# Altium project W65C22N6TPLG-14 to DIP VIA 6522 Adapter.PrjPcb
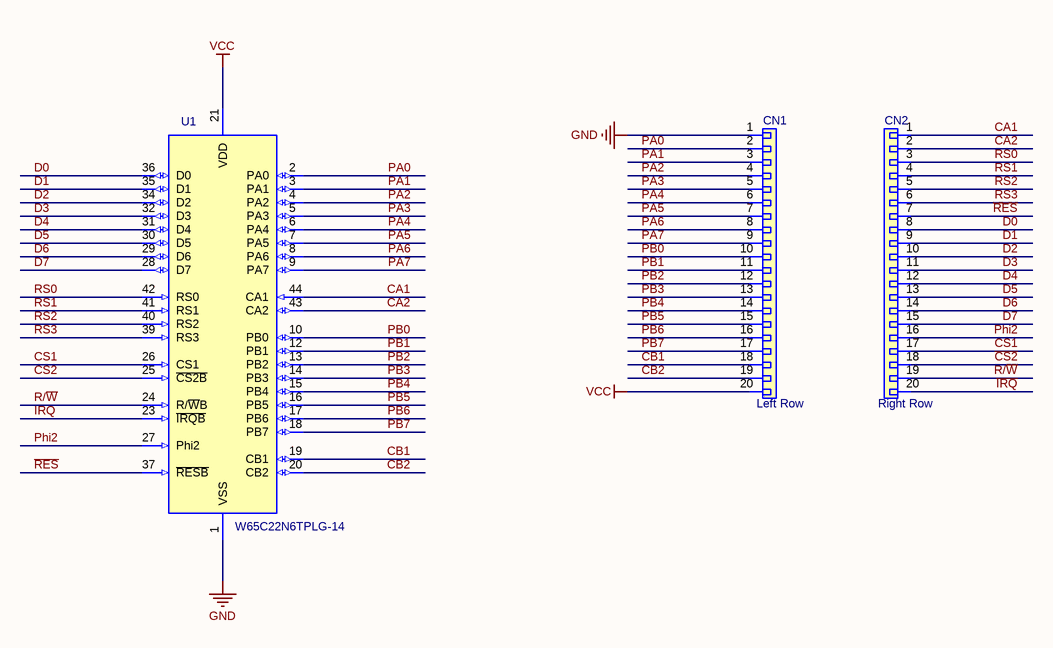
[diagram p0: W65C22N6TPLG-14 to DIP VIA 6522 Adapter.SchDoc]
Author: PCB-Tech; Revision: A; Title: Projektname; Version: 1.0
1 sheet, 3 parts. Net scope: global (net labels, ports and power ports of the same name join across sheets).
Board file: W65C22N6TPLG-14 to DIP VIA 6522 Adapter.PcbDoc

## Sheet W65C22N6TPLG-14 to DIP VIA 6522 Adapter.SchDoc: W65C22N6TPLG-14 to DIP VIA 6522 Adapter
size 297 x 209 mm; ApprovedBy: .; CheckedBy: .; Author: DiWou; CompanyName: DL2DW; DrawnBy: DiWou; Engineer: .; Organization: DL2DW; DocumentNumber: 1; Revision: -; SheetNumber: 1; SheetTotal: 1; DrawnDate: 03.09.2019; EngrDate: .; ChkdDate: .; Title1: W65C22N6TPLG-14 to; Title2: DIP VIA 6522 Adapterq; Title3: .; Desc1: Version 1.0; Desc2: .; ApprDate: .

### Parts
CN1  Left Row  [Pin Header 01x20 2.54mm precision Horizontal Male]
CN2  Right Row  [Pin Header 01x20 2.54mm precision Horizontal Male]
U1  W65C22N6TPLG-14  [W65C22N6TPLG-14 with PLCC Socket]

### Nets
GND: CN1.1 U1.1(VSS)
VCC: CN1.20 U1.21(VDD)
~{CS2}: CN2.18 U1.25(~{CS2B})
CA1: CN2.1 U1.44(CA1)
CA2: CN2.2 U1.43(CA2)
CB1: CN1.18 U1.19(CB1)
CB2: CN1.19 U1.20(CB2)
CS1: CN2.17 U1.26(CS1)
D0: CN2.8 U1.36(D0)
D1: CN2.9 U1.35(D1)
D2: CN2.10 U1.34(D2)
D3: CN2.11 U1.32(D3)
D4: CN2.12 U1.31(D4)
D5: CN2.13 U1.30(D5)
D6: CN2.14 U1.29(D6)
D7: CN2.15 U1.28(D7)
~{IRQ}: CN2.20 U1.23(~{IRQB})
PA0: CN1.2 U1.2(PA0)
PA1: CN1.3 U1.3(PA1)
PA2: CN1.4 U1.4(PA2)
PA3: CN1.5 U1.5(PA3)
PA4: CN1.6 U1.6(PA4)
PA5: CN1.7 U1.7(PA5)
PA6: CN1.8 U1.8(PA6)
PA7: CN1.9 U1.9(PA7)
PB0: CN1.10 U1.10(PB0)
PB1: CN1.11 U1.12(PB1)
PB2: CN1.12 U1.13(PB2)
PB3: CN1.13 U1.14(PB3)
PB4: CN1.14 U1.15(PB4)
PB5: CN1.15 U1.16(PB5)
PB6: CN1.16 U1.17(PB6)
PB7: CN1.17 U1.18(PB7)
Phi2: CN2.16 U1.27(Phi2)
R/~{W}: CN2.19 U1.24(R/~{W}B)
~{RES}: CN2.7 U1.37(~{RESB})
RS0: CN2.3 U1.42(RS0)
RS1: CN2.4 U1.41(RS1)
RS2: CN2.5 U1.40(RS2)
RS3: CN2.6 U1.39(RS3)

Not connected (* = marked no-connect by the designer): U1 11(NC) 22(NC) 33(NC) 38(NC)

### Notes on the sheet
- Drawn by:
- Date
- Size:
- A4
- Rev:
- Engr:
- Chkd:
- Appr:
- File:
- Document No:
- Print Date & Time:
- /
- Sheet
- of

### Library data of the parts
CN1 CN2 = CMP-Connectors-Male_PIN_Headers-00031-2: Conn Header Vert 20POS 2MM; Connector Type: Male Pin; Number of Positions: 20; Pitch: 0.079inch; Contact Mating Length: 0.141inch; Package Quantity: 250; Mount: Through Hole; Color: Black; Packaging: Bulk; Contact Plating: Gold; Number of Rows: 1; Termination: Solder
U1 = CMP-ICs-Specials-00024-3: I/O Controller Interface IC Versatile Interface Adapter; Operating Supply Voltage: 5V; Data Bus Width: 8b; Operating Supply Current: 500uA; Interface: Serial; Packaging: Rail/Tube; Min Operating Temperature: -40°C; Case/Package: PLCC; Weight: 0.084185oz; Max Operating Temperature: 85°C